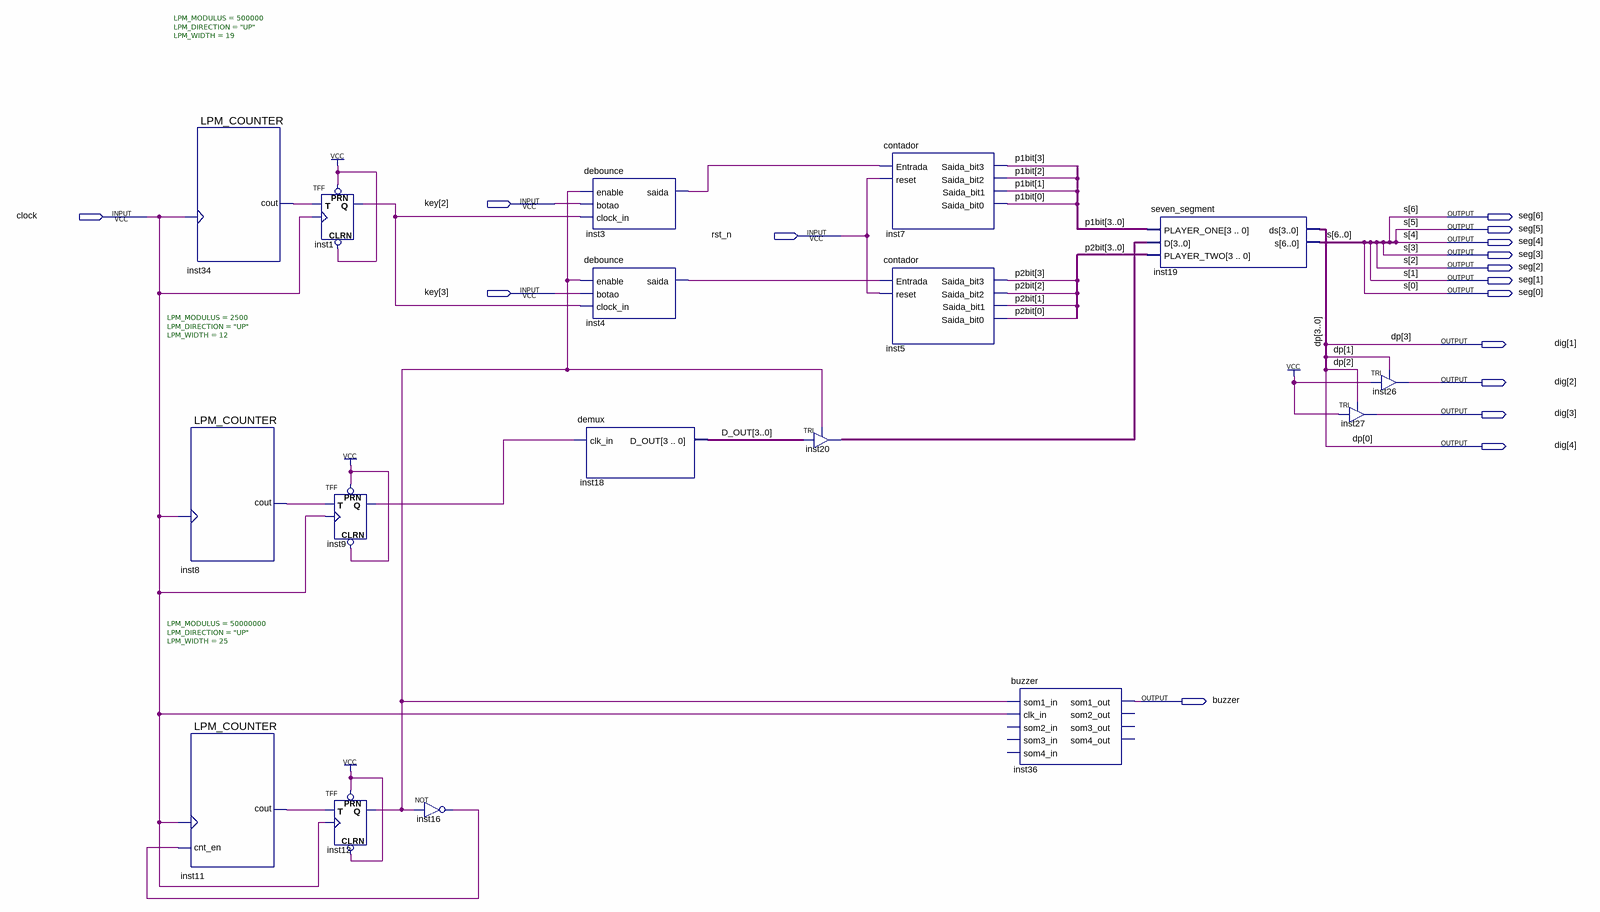
[diagram p0: schematic sheet]
// Quartus schematic top.bdf as structural Verilog: 17 symbols, 16 pins
module top (
  input  [3:2] key,
  input  clock,
  input  rst_n,
  output [6:0] seg,
  output [4:1] dig,
  output buzzer
);

  wire inst1_q, inst3_saida, inst4_saida, inst8_cout, inst9_q, inst11_cout, inst12_q, inst16_out, inst34_cout;
  wire [2:1] dp;
  wire [3:0] D_OUT, inst20_out, p1bit, p2bit;

  LPM_COUNTER #(.LPM_MODULUS(500000), .LPM_DIRECTION("UP"), .LPM_WIDTH(19)) inst34 (.clock(clock), .cout(inst34_cout));
  LPM_COUNTER #(.LPM_MODULUS(2500), .LPM_DIRECTION("UP"), .LPM_WIDTH(12)) inst8 (.clock(clock), .cout(inst8_cout));
  LPM_COUNTER #(.LPM_MODULUS(50000000), .LPM_DIRECTION("UP"), .LPM_WIDTH(25)) inst11 (
    .clock(clock), .cnt_en(inst16_out), .cout(inst11_cout));
  TFF inst1 (.PRN(1'b1), .CLRN(1'b1), .T(inst34_cout), .CLK(clock), .Q(inst1_q));
  TFF inst9 (.PRN(1'b1), .CLRN(1'b1), .T(inst8_cout), .CLK(clock), .Q(inst9_q));
  TFF inst12 (.PRN(1'b1), .CLRN(1'b1), .T(inst11_cout), .CLK(clock), .Q(inst12_q));
  not inst16 (inst16_out, inst12_q);
  debounce inst3 (.enable(inst12_q), .botao(key[2]), .clock_in(inst1_q), .saida(inst3_saida));
  debounce inst4 (.enable(inst12_q), .botao(key[3]), .clock_in(inst1_q), .saida(inst4_saida));
  demux inst18 (.clk_in(inst9_q), .D_OUT(D_OUT));
  TRI inst20[3:0] (.IN(D_OUT), .OE(inst12_q), .OUT(inst20_out));
  contador inst7 (
    .Entrada(inst3_saida), .reset(rst_n), .Saida_bit3(p1bit[3]), .Saida_bit2(p1bit[2]),
    .Saida_bit1(p1bit[1]), .Saida_bit0(p1bit[0]));
  contador inst5 (
    .Entrada(inst4_saida), .reset(rst_n), .Saida_bit3(p2bit[3]), .Saida_bit2(p2bit[2]),
    .Saida_bit1(p2bit[1]), .Saida_bit0(p2bit[0]));
  buzzer inst36 (
    .som1_in(inst12_q), .clk_in(clock), .som1_out(buzzer));  // open: som2_in, som3_in, som4_in, som2_out, som3_out, som4_out
  seven_segment inst19 (.PLAYER_ONE(p1bit), .D(inst20_out), .PLAYER_TWO(p2bit), .ds({dig[1], dp, dig[4]}), .s(seg));
  TRI inst26 (.IN(1'b1), .OE(dp[1]), .OUT(dig[2]));
  TRI inst27 (.IN(1'b1), .OE(dp[2]), .OUT(dig[3]));

  // Other names for the same wires on the sheet: dp (some bits) = {dig[1], dig[4]}; s[6:0] = seg
endmodule
